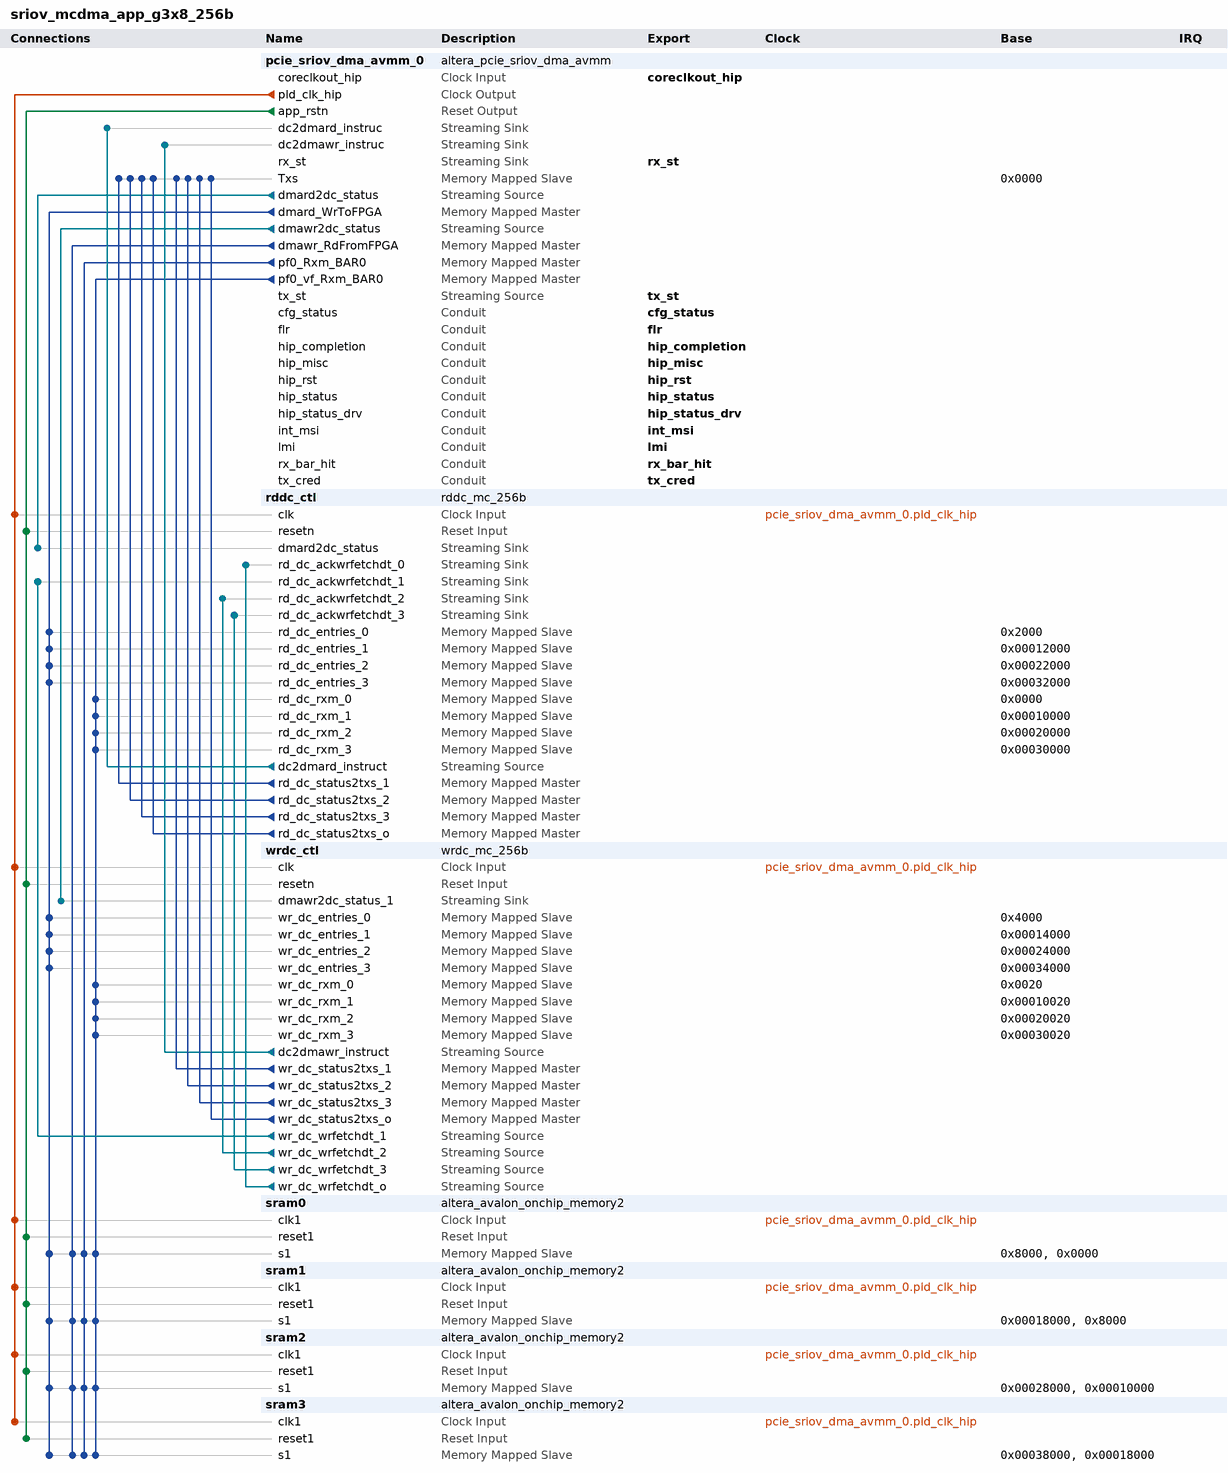
[diagram p0: system contents]
# Platform Designer (Qsys) system sriov_mcdma_app_g3x8_256b, Stratix V Unknown
# Parameters at their usual value, and those the tool derives, are not listed.
package require -exact qsys 14.1
create_system sriov_mcdma_app_g3x8_256b
set_project_property DEVICE_FAMILY {Stratix V}
set_project_property DEVICE Unknown

add_instance pcie_sriov_dma_avmm_0 altera_pcie_sriov_dma_avmm 14.1
set_instance_parameter_value pcie_sriov_dma_avmm_0 ACTIVE_VFS 2
set_instance_parameter_value pcie_sriov_dma_avmm_0 ARI_SUPPORT 1
set_instance_parameter_value pcie_sriov_dma_avmm_0 CB_P2A_AVALON_ADDR_B0 0x00000000
set_instance_parameter_value pcie_sriov_dma_avmm_0 CB_P2A_AVALON_ADDR_B1 0x00000000
set_instance_parameter_value pcie_sriov_dma_avmm_0 CB_P2A_AVALON_ADDR_B2 0x00000000
set_instance_parameter_value pcie_sriov_dma_avmm_0 CB_P2A_AVALON_ADDR_B3 0x00000000
set_instance_parameter_value pcie_sriov_dma_avmm_0 CB_P2A_AVALON_ADDR_B4 0x00000000
set_instance_parameter_value pcie_sriov_dma_avmm_0 CB_P2A_AVALON_ADDR_B5 0x00000000
set_instance_parameter_value pcie_sriov_dma_avmm_0 CB_P2A_FIXED_AVALON_ADDR_B0 0
set_instance_parameter_value pcie_sriov_dma_avmm_0 CB_P2A_FIXED_AVALON_ADDR_B1 0
set_instance_parameter_value pcie_sriov_dma_avmm_0 CB_P2A_FIXED_AVALON_ADDR_B2 0
set_instance_parameter_value pcie_sriov_dma_avmm_0 CB_P2A_FIXED_AVALON_ADDR_B3 0
set_instance_parameter_value pcie_sriov_dma_avmm_0 CB_P2A_FIXED_AVALON_ADDR_B4 0
set_instance_parameter_value pcie_sriov_dma_avmm_0 CB_P2A_FIXED_AVALON_ADDR_B5 0
set_instance_parameter_value pcie_sriov_dma_avmm_0 CG_COMMON_CLOCK_MODE 1
set_instance_parameter_value pcie_sriov_dma_avmm_0 CG_RXM_IRQ_NUM 16
set_instance_parameter_value pcie_sriov_dma_avmm_0 COMPLETER_ONLY_HWTCL 0
set_instance_parameter_value pcie_sriov_dma_avmm_0 NUM_PREFETCH_MASTERS 1
set_instance_parameter_value pcie_sriov_dma_avmm_0 PF0_BAR0_PRESENT 1
set_instance_parameter_value pcie_sriov_dma_avmm_0 PF0_BAR0_SIZE 17
set_instance_parameter_value pcie_sriov_dma_avmm_0 PF0_BAR0_TYPE 64
set_instance_parameter_value pcie_sriov_dma_avmm_0 PF0_BAR1_PRESENT 0
set_instance_parameter_value pcie_sriov_dma_avmm_0 PF0_BAR1_SIZE 12
set_instance_parameter_value pcie_sriov_dma_avmm_0 PF0_BAR2_PRESENT 0
set_instance_parameter_value pcie_sriov_dma_avmm_0 PF0_BAR2_SIZE 12
set_instance_parameter_value pcie_sriov_dma_avmm_0 PF0_BAR2_TYPE 64
set_instance_parameter_value pcie_sriov_dma_avmm_0 PF0_BAR3_PRESENT 0
set_instance_parameter_value pcie_sriov_dma_avmm_0 PF0_BAR3_SIZE 12
set_instance_parameter_value pcie_sriov_dma_avmm_0 PF0_BAR4_PRESENT 0
set_instance_parameter_value pcie_sriov_dma_avmm_0 PF0_BAR4_SIZE 12
set_instance_parameter_value pcie_sriov_dma_avmm_0 PF0_BAR4_TYPE 64
set_instance_parameter_value pcie_sriov_dma_avmm_0 PF0_BAR5_PRESENT 0
set_instance_parameter_value pcie_sriov_dma_avmm_0 PF0_BAR5_SIZE 12
set_instance_parameter_value pcie_sriov_dma_avmm_0 PF0_VF_BAR0_PRESENT 1
set_instance_parameter_value pcie_sriov_dma_avmm_0 PF0_VF_BAR0_SIZE 16
set_instance_parameter_value pcie_sriov_dma_avmm_0 PF0_VF_BAR0_TYPE 64
set_instance_parameter_value pcie_sriov_dma_avmm_0 PF0_VF_BAR1_PRESENT 0
set_instance_parameter_value pcie_sriov_dma_avmm_0 PF0_VF_BAR1_SIZE 12
set_instance_parameter_value pcie_sriov_dma_avmm_0 PF0_VF_BAR2_PRESENT 0
set_instance_parameter_value pcie_sriov_dma_avmm_0 PF0_VF_BAR2_SIZE 12
set_instance_parameter_value pcie_sriov_dma_avmm_0 PF0_VF_BAR2_TYPE 64
set_instance_parameter_value pcie_sriov_dma_avmm_0 PF0_VF_BAR3_PRESENT 0
set_instance_parameter_value pcie_sriov_dma_avmm_0 PF0_VF_BAR3_SIZE 12
set_instance_parameter_value pcie_sriov_dma_avmm_0 PF0_VF_BAR4_PRESENT 0
set_instance_parameter_value pcie_sriov_dma_avmm_0 PF0_VF_BAR4_SIZE 12
set_instance_parameter_value pcie_sriov_dma_avmm_0 PF0_VF_BAR4_TYPE 64
set_instance_parameter_value pcie_sriov_dma_avmm_0 PF0_VF_BAR5_PRESENT 0
set_instance_parameter_value pcie_sriov_dma_avmm_0 PF0_VF_BAR5_SIZE 12
set_instance_parameter_value pcie_sriov_dma_avmm_0 PF0_VF_COUNT_USER 4
set_instance_parameter_value pcie_sriov_dma_avmm_0 PF0_VF_RXM_ADDR_MAP0 18
set_instance_parameter_value pcie_sriov_dma_avmm_0 PF0_VF_RXM_ADDR_MAP1 0
set_instance_parameter_value pcie_sriov_dma_avmm_0 PF0_VF_RXM_ADDR_MAP2 0
set_instance_parameter_value pcie_sriov_dma_avmm_0 PF0_VF_RXM_ADDR_MAP3 0
set_instance_parameter_value pcie_sriov_dma_avmm_0 PF0_VF_RXM_ADDR_MAP4 0
set_instance_parameter_value pcie_sriov_dma_avmm_0 PF0_VF_RXM_ADDR_MAP5 0
set_instance_parameter_value pcie_sriov_dma_avmm_0 PF1_VF_COUNT_USER 0
set_instance_parameter_value pcie_sriov_dma_avmm_0 RD_SLAVE_ADDRESS_MAP 18
set_instance_parameter_value pcie_sriov_dma_avmm_0 SLAVE_ADDRESS_MAP_0 0
set_instance_parameter_value pcie_sriov_dma_avmm_0 SLAVE_ADDRESS_MAP_1 0
set_instance_parameter_value pcie_sriov_dma_avmm_0 SLAVE_ADDRESS_MAP_2 0
set_instance_parameter_value pcie_sriov_dma_avmm_0 SLAVE_ADDRESS_MAP_3 0
set_instance_parameter_value pcie_sriov_dma_avmm_0 SLAVE_ADDRESS_MAP_4 0
set_instance_parameter_value pcie_sriov_dma_avmm_0 SLAVE_ADDRESS_MAP_5 0
set_instance_parameter_value pcie_sriov_dma_avmm_0 SR_IOV_SUPPORT 1
set_instance_parameter_value pcie_sriov_dma_avmm_0 TOTAL_PF_COUNT 1
set_instance_parameter_value pcie_sriov_dma_avmm_0 TX_S_ADDR_WIDTH 56
set_instance_parameter_value pcie_sriov_dma_avmm_0 WR_SLAVE_ADDRESS_MAP 18
set_instance_parameter_value pcie_sriov_dma_avmm_0 avmm_width_hwtcl 256
set_instance_parameter_value pcie_sriov_dma_avmm_0 enable_cra_hwtcl 0
set_instance_parameter_value pcie_sriov_dma_avmm_0 enable_int_hwtcl 1
set_instance_parameter_value pcie_sriov_dma_avmm_0 enable_lmi_hwtcl 1
set_instance_parameter_value pcie_sriov_dma_avmm_0 enable_rxm_burst_hwtcl 0
set_instance_parameter_value pcie_sriov_dma_avmm_0 fixed_address_mode 0
set_instance_parameter_value pcie_sriov_dma_avmm_0 gen123_lane_rate_mode_hwtcl {Gen3 (8.0 Gbps)}
set_instance_parameter_value pcie_sriov_dma_avmm_0 lane_mask_hwtcl x8
set_instance_parameter_value pcie_sriov_dma_avmm_0 multiple_packets_per_cycle_hwtcl 0
set_instance_parameter_value pcie_sriov_dma_avmm_0 pcie_qsys 1
set_instance_parameter_value pcie_sriov_dma_avmm_0 port_type_hwtcl {Native endpoint}
set_instance_parameter_value pcie_sriov_dma_avmm_0 set_pld_clk_x1_625MHz_hwtcl 0
set_instance_parameter_value pcie_sriov_dma_avmm_0 use_atx_pll_hwtcl 0
set_instance_parameter_value pcie_sriov_dma_avmm_0 use_tx_cons_cred_sel_hwtcl 0

add_instance rddc_ctl rddc_mc_256b 1.0

add_instance wrdc_ctl wrdc_mc_256b 1.0

add_instance sram0 altera_avalon_onchip_memory2 14.1
set_instance_parameter_value sram0 dataWidth 256
set_instance_parameter_value sram0 dualPort false
set_instance_parameter_value sram0 initMemContent true
set_instance_parameter_value sram0 initializationFileName onchip_mem.hex
set_instance_parameter_value sram0 memorySize 32768

add_instance sram1 altera_avalon_onchip_memory2 14.1
set_instance_parameter_value sram1 dataWidth 256
set_instance_parameter_value sram1 dualPort false
set_instance_parameter_value sram1 initMemContent true
set_instance_parameter_value sram1 initializationFileName onchip_mem.hex
set_instance_parameter_value sram1 memorySize 32768

add_instance sram2 altera_avalon_onchip_memory2 14.1
set_instance_parameter_value sram2 dataWidth 256
set_instance_parameter_value sram2 dualPort false
set_instance_parameter_value sram2 initMemContent true
set_instance_parameter_value sram2 initializationFileName onchip_mem.hex
set_instance_parameter_value sram2 memorySize 32768

add_instance sram3 altera_avalon_onchip_memory2 14.1
set_instance_parameter_value sram3 dataWidth 256
set_instance_parameter_value sram3 dualPort false
set_instance_parameter_value sram3 initMemContent true
set_instance_parameter_value sram3 initializationFileName onchip_mem.hex
set_instance_parameter_value sram3 memorySize 32768

# connections
add_connection pcie_sriov_dma_avmm_0.pld_clk_hip rddc_ctl.clk clock
add_connection pcie_sriov_dma_avmm_0.pld_clk_hip sram0.clk1 clock
add_connection pcie_sriov_dma_avmm_0.pld_clk_hip sram1.clk1 clock
add_connection pcie_sriov_dma_avmm_0.pld_clk_hip sram2.clk1 clock
add_connection pcie_sriov_dma_avmm_0.pld_clk_hip sram3.clk1 clock
add_connection pcie_sriov_dma_avmm_0.pld_clk_hip wrdc_ctl.clk clock
add_connection pcie_sriov_dma_avmm_0.app_rstn rddc_ctl.resetn reset
add_connection pcie_sriov_dma_avmm_0.app_rstn sram0.reset1 reset
add_connection pcie_sriov_dma_avmm_0.app_rstn sram1.reset1 reset
add_connection pcie_sriov_dma_avmm_0.app_rstn sram2.reset1 reset
add_connection pcie_sriov_dma_avmm_0.app_rstn sram3.reset1 reset
add_connection pcie_sriov_dma_avmm_0.app_rstn wrdc_ctl.resetn reset
add_connection pcie_sriov_dma_avmm_0.dmard_WrToFPGA rddc_ctl.rd_dc_entries_0 avalon
set_connection_parameter_value pcie_sriov_dma_avmm_0.dmard_WrToFPGA/rddc_ctl.rd_dc_entries_0 baseAddress 0x2000
add_connection pcie_sriov_dma_avmm_0.dmard_WrToFPGA rddc_ctl.rd_dc_entries_1 avalon
set_connection_parameter_value pcie_sriov_dma_avmm_0.dmard_WrToFPGA/rddc_ctl.rd_dc_entries_1 baseAddress 0x00012000
add_connection pcie_sriov_dma_avmm_0.dmard_WrToFPGA rddc_ctl.rd_dc_entries_2 avalon
set_connection_parameter_value pcie_sriov_dma_avmm_0.dmard_WrToFPGA/rddc_ctl.rd_dc_entries_2 baseAddress 0x00022000
add_connection pcie_sriov_dma_avmm_0.dmard_WrToFPGA rddc_ctl.rd_dc_entries_3 avalon
set_connection_parameter_value pcie_sriov_dma_avmm_0.dmard_WrToFPGA/rddc_ctl.rd_dc_entries_3 baseAddress 0x00032000
add_connection pcie_sriov_dma_avmm_0.dmard_WrToFPGA sram0.s1 avalon
set_connection_parameter_value pcie_sriov_dma_avmm_0.dmard_WrToFPGA/sram0.s1 baseAddress 0x8000
add_connection pcie_sriov_dma_avmm_0.dmard_WrToFPGA sram1.s1 avalon
set_connection_parameter_value pcie_sriov_dma_avmm_0.dmard_WrToFPGA/sram1.s1 baseAddress 0x00018000
add_connection pcie_sriov_dma_avmm_0.dmard_WrToFPGA sram2.s1 avalon
set_connection_parameter_value pcie_sriov_dma_avmm_0.dmard_WrToFPGA/sram2.s1 baseAddress 0x00028000
add_connection pcie_sriov_dma_avmm_0.dmard_WrToFPGA sram3.s1 avalon
set_connection_parameter_value pcie_sriov_dma_avmm_0.dmard_WrToFPGA/sram3.s1 baseAddress 0x00038000
add_connection pcie_sriov_dma_avmm_0.dmard_WrToFPGA wrdc_ctl.wr_dc_entries_0 avalon
set_connection_parameter_value pcie_sriov_dma_avmm_0.dmard_WrToFPGA/wrdc_ctl.wr_dc_entries_0 baseAddress 0x4000
add_connection pcie_sriov_dma_avmm_0.dmard_WrToFPGA wrdc_ctl.wr_dc_entries_1 avalon
set_connection_parameter_value pcie_sriov_dma_avmm_0.dmard_WrToFPGA/wrdc_ctl.wr_dc_entries_1 baseAddress 0x00014000
add_connection pcie_sriov_dma_avmm_0.dmard_WrToFPGA wrdc_ctl.wr_dc_entries_2 avalon
set_connection_parameter_value pcie_sriov_dma_avmm_0.dmard_WrToFPGA/wrdc_ctl.wr_dc_entries_2 baseAddress 0x00024000
add_connection pcie_sriov_dma_avmm_0.dmard_WrToFPGA wrdc_ctl.wr_dc_entries_3 avalon
set_connection_parameter_value pcie_sriov_dma_avmm_0.dmard_WrToFPGA/wrdc_ctl.wr_dc_entries_3 baseAddress 0x00034000
add_connection pcie_sriov_dma_avmm_0.dmawr_RdFromFPGA sram0.s1 avalon
set_connection_parameter_value pcie_sriov_dma_avmm_0.dmawr_RdFromFPGA/sram0.s1 baseAddress 0x8000
add_connection pcie_sriov_dma_avmm_0.dmawr_RdFromFPGA sram1.s1 avalon
set_connection_parameter_value pcie_sriov_dma_avmm_0.dmawr_RdFromFPGA/sram1.s1 baseAddress 0x00018000
add_connection pcie_sriov_dma_avmm_0.dmawr_RdFromFPGA sram2.s1 avalon
set_connection_parameter_value pcie_sriov_dma_avmm_0.dmawr_RdFromFPGA/sram2.s1 baseAddress 0x00028000
add_connection pcie_sriov_dma_avmm_0.dmawr_RdFromFPGA sram3.s1 avalon
set_connection_parameter_value pcie_sriov_dma_avmm_0.dmawr_RdFromFPGA/sram3.s1 baseAddress 0x00038000
add_connection pcie_sriov_dma_avmm_0.pf0_Rxm_BAR0 sram0.s1 avalon
set_connection_parameter_value pcie_sriov_dma_avmm_0.pf0_Rxm_BAR0/sram0.s1 baseAddress 0x0000
add_connection pcie_sriov_dma_avmm_0.pf0_Rxm_BAR0 sram1.s1 avalon
set_connection_parameter_value pcie_sriov_dma_avmm_0.pf0_Rxm_BAR0/sram1.s1 baseAddress 0x8000
add_connection pcie_sriov_dma_avmm_0.pf0_Rxm_BAR0 sram2.s1 avalon
set_connection_parameter_value pcie_sriov_dma_avmm_0.pf0_Rxm_BAR0/sram2.s1 baseAddress 0x00010000
add_connection pcie_sriov_dma_avmm_0.pf0_Rxm_BAR0 sram3.s1 avalon
set_connection_parameter_value pcie_sriov_dma_avmm_0.pf0_Rxm_BAR0/sram3.s1 baseAddress 0x00018000
add_connection pcie_sriov_dma_avmm_0.pf0_vf_Rxm_BAR0 rddc_ctl.rd_dc_rxm_0 avalon
set_connection_parameter_value pcie_sriov_dma_avmm_0.pf0_vf_Rxm_BAR0/rddc_ctl.rd_dc_rxm_0 baseAddress 0x0000
add_connection pcie_sriov_dma_avmm_0.pf0_vf_Rxm_BAR0 rddc_ctl.rd_dc_rxm_1 avalon
set_connection_parameter_value pcie_sriov_dma_avmm_0.pf0_vf_Rxm_BAR0/rddc_ctl.rd_dc_rxm_1 baseAddress 0x00010000
add_connection pcie_sriov_dma_avmm_0.pf0_vf_Rxm_BAR0 rddc_ctl.rd_dc_rxm_2 avalon
set_connection_parameter_value pcie_sriov_dma_avmm_0.pf0_vf_Rxm_BAR0/rddc_ctl.rd_dc_rxm_2 baseAddress 0x00020000
add_connection pcie_sriov_dma_avmm_0.pf0_vf_Rxm_BAR0 rddc_ctl.rd_dc_rxm_3 avalon
set_connection_parameter_value pcie_sriov_dma_avmm_0.pf0_vf_Rxm_BAR0/rddc_ctl.rd_dc_rxm_3 baseAddress 0x00030000
add_connection pcie_sriov_dma_avmm_0.pf0_vf_Rxm_BAR0 sram0.s1 avalon
set_connection_parameter_value pcie_sriov_dma_avmm_0.pf0_vf_Rxm_BAR0/sram0.s1 baseAddress 0x8000
add_connection pcie_sriov_dma_avmm_0.pf0_vf_Rxm_BAR0 sram1.s1 avalon
set_connection_parameter_value pcie_sriov_dma_avmm_0.pf0_vf_Rxm_BAR0/sram1.s1 baseAddress 0x00018000
add_connection pcie_sriov_dma_avmm_0.pf0_vf_Rxm_BAR0 sram2.s1 avalon
set_connection_parameter_value pcie_sriov_dma_avmm_0.pf0_vf_Rxm_BAR0/sram2.s1 baseAddress 0x00028000
add_connection pcie_sriov_dma_avmm_0.pf0_vf_Rxm_BAR0 sram3.s1 avalon
set_connection_parameter_value pcie_sriov_dma_avmm_0.pf0_vf_Rxm_BAR0/sram3.s1 baseAddress 0x00038000
add_connection pcie_sriov_dma_avmm_0.pf0_vf_Rxm_BAR0 wrdc_ctl.wr_dc_rxm_0 avalon
set_connection_parameter_value pcie_sriov_dma_avmm_0.pf0_vf_Rxm_BAR0/wrdc_ctl.wr_dc_rxm_0 baseAddress 0x0020
add_connection pcie_sriov_dma_avmm_0.pf0_vf_Rxm_BAR0 wrdc_ctl.wr_dc_rxm_1 avalon
set_connection_parameter_value pcie_sriov_dma_avmm_0.pf0_vf_Rxm_BAR0/wrdc_ctl.wr_dc_rxm_1 baseAddress 0x00010020
add_connection pcie_sriov_dma_avmm_0.pf0_vf_Rxm_BAR0 wrdc_ctl.wr_dc_rxm_2 avalon
set_connection_parameter_value pcie_sriov_dma_avmm_0.pf0_vf_Rxm_BAR0/wrdc_ctl.wr_dc_rxm_2 baseAddress 0x00020020
add_connection pcie_sriov_dma_avmm_0.pf0_vf_Rxm_BAR0 wrdc_ctl.wr_dc_rxm_3 avalon
set_connection_parameter_value pcie_sriov_dma_avmm_0.pf0_vf_Rxm_BAR0/wrdc_ctl.wr_dc_rxm_3 baseAddress 0x00030020
add_connection rddc_ctl.rd_dc_status2txs_1 pcie_sriov_dma_avmm_0.Txs avalon
set_connection_parameter_value rddc_ctl.rd_dc_status2txs_1/pcie_sriov_dma_avmm_0.Txs baseAddress 0x0000
add_connection rddc_ctl.rd_dc_status2txs_2 pcie_sriov_dma_avmm_0.Txs avalon
set_connection_parameter_value rddc_ctl.rd_dc_status2txs_2/pcie_sriov_dma_avmm_0.Txs baseAddress 0x0000
add_connection rddc_ctl.rd_dc_status2txs_3 pcie_sriov_dma_avmm_0.Txs avalon
set_connection_parameter_value rddc_ctl.rd_dc_status2txs_3/pcie_sriov_dma_avmm_0.Txs baseAddress 0x0000
add_connection rddc_ctl.rd_dc_status2txs_o pcie_sriov_dma_avmm_0.Txs avalon
set_connection_parameter_value rddc_ctl.rd_dc_status2txs_o/pcie_sriov_dma_avmm_0.Txs baseAddress 0x0000
add_connection wrdc_ctl.wr_dc_status2txs_1 pcie_sriov_dma_avmm_0.Txs avalon
set_connection_parameter_value wrdc_ctl.wr_dc_status2txs_1/pcie_sriov_dma_avmm_0.Txs baseAddress 0x0000
add_connection wrdc_ctl.wr_dc_status2txs_2 pcie_sriov_dma_avmm_0.Txs avalon
set_connection_parameter_value wrdc_ctl.wr_dc_status2txs_2/pcie_sriov_dma_avmm_0.Txs baseAddress 0x0000
add_connection wrdc_ctl.wr_dc_status2txs_3 pcie_sriov_dma_avmm_0.Txs avalon
set_connection_parameter_value wrdc_ctl.wr_dc_status2txs_3/pcie_sriov_dma_avmm_0.Txs baseAddress 0x0000
add_connection wrdc_ctl.wr_dc_status2txs_o pcie_sriov_dma_avmm_0.Txs avalon
set_connection_parameter_value wrdc_ctl.wr_dc_status2txs_o/pcie_sriov_dma_avmm_0.Txs baseAddress 0x0000
add_connection pcie_sriov_dma_avmm_0.dmard2dc_status rddc_ctl.dmard2dc_status avalon_streaming
add_connection pcie_sriov_dma_avmm_0.dmawr2dc_status wrdc_ctl.dmawr2dc_status_1 avalon_streaming
add_connection rddc_ctl.dc2dmard_instruct pcie_sriov_dma_avmm_0.dc2dmard_instruc avalon_streaming
add_connection wrdc_ctl.dc2dmawr_instruct pcie_sriov_dma_avmm_0.dc2dmawr_instruc avalon_streaming
add_connection wrdc_ctl.wr_dc_wrfetchdt_1 rddc_ctl.rd_dc_ackwrfetchdt_1 avalon_streaming
add_connection wrdc_ctl.wr_dc_wrfetchdt_2 rddc_ctl.rd_dc_ackwrfetchdt_2 avalon_streaming
add_connection wrdc_ctl.wr_dc_wrfetchdt_3 rddc_ctl.rd_dc_ackwrfetchdt_3 avalon_streaming
add_connection wrdc_ctl.wr_dc_wrfetchdt_o rddc_ctl.rd_dc_ackwrfetchdt_0 avalon_streaming

# exported interfaces
add_interface cfg_status conduit end
set_interface_property cfg_status EXPORT_OF pcie_sriov_dma_avmm_0.cfg_status
add_interface coreclkout_hip clock sink
set_interface_property coreclkout_hip EXPORT_OF pcie_sriov_dma_avmm_0.coreclkout_hip
add_interface flr conduit end
set_interface_property flr EXPORT_OF pcie_sriov_dma_avmm_0.flr
add_interface hip_completion conduit end
set_interface_property hip_completion EXPORT_OF pcie_sriov_dma_avmm_0.hip_completion
add_interface hip_misc conduit end
set_interface_property hip_misc EXPORT_OF pcie_sriov_dma_avmm_0.hip_misc
add_interface hip_rst conduit end
set_interface_property hip_rst EXPORT_OF pcie_sriov_dma_avmm_0.hip_rst
add_interface hip_status conduit end
set_interface_property hip_status EXPORT_OF pcie_sriov_dma_avmm_0.hip_status
add_interface hip_status_drv conduit end
set_interface_property hip_status_drv EXPORT_OF pcie_sriov_dma_avmm_0.hip_status_drv
add_interface int_msi conduit end
set_interface_property int_msi EXPORT_OF pcie_sriov_dma_avmm_0.int_msi
add_interface lmi conduit end
set_interface_property lmi EXPORT_OF pcie_sriov_dma_avmm_0.lmi
add_interface rx_bar_hit conduit end
set_interface_property rx_bar_hit EXPORT_OF pcie_sriov_dma_avmm_0.rx_bar_hit
add_interface rx_st avalon_streaming sink
set_interface_property rx_st EXPORT_OF pcie_sriov_dma_avmm_0.rx_st
add_interface tx_cred conduit end
set_interface_property tx_cred EXPORT_OF pcie_sriov_dma_avmm_0.tx_cred
add_interface tx_st avalon_streaming source
set_interface_property tx_st EXPORT_OF pcie_sriov_dma_avmm_0.tx_st

set_interconnect_requirement {$system} qsys_mm.clockCrossingAdapter HANDSHAKE
set_interconnect_requirement {$system} qsys_mm.insertDefaultSlave FALSE
set_interconnect_requirement {$system} qsys_mm.maxAdditionalLatency 1

save_system sriov_mcdma_app_g3x8_256b.qsys
